# Altium schematic sheet Magnetorquer_drivers.SchDoc
size A4
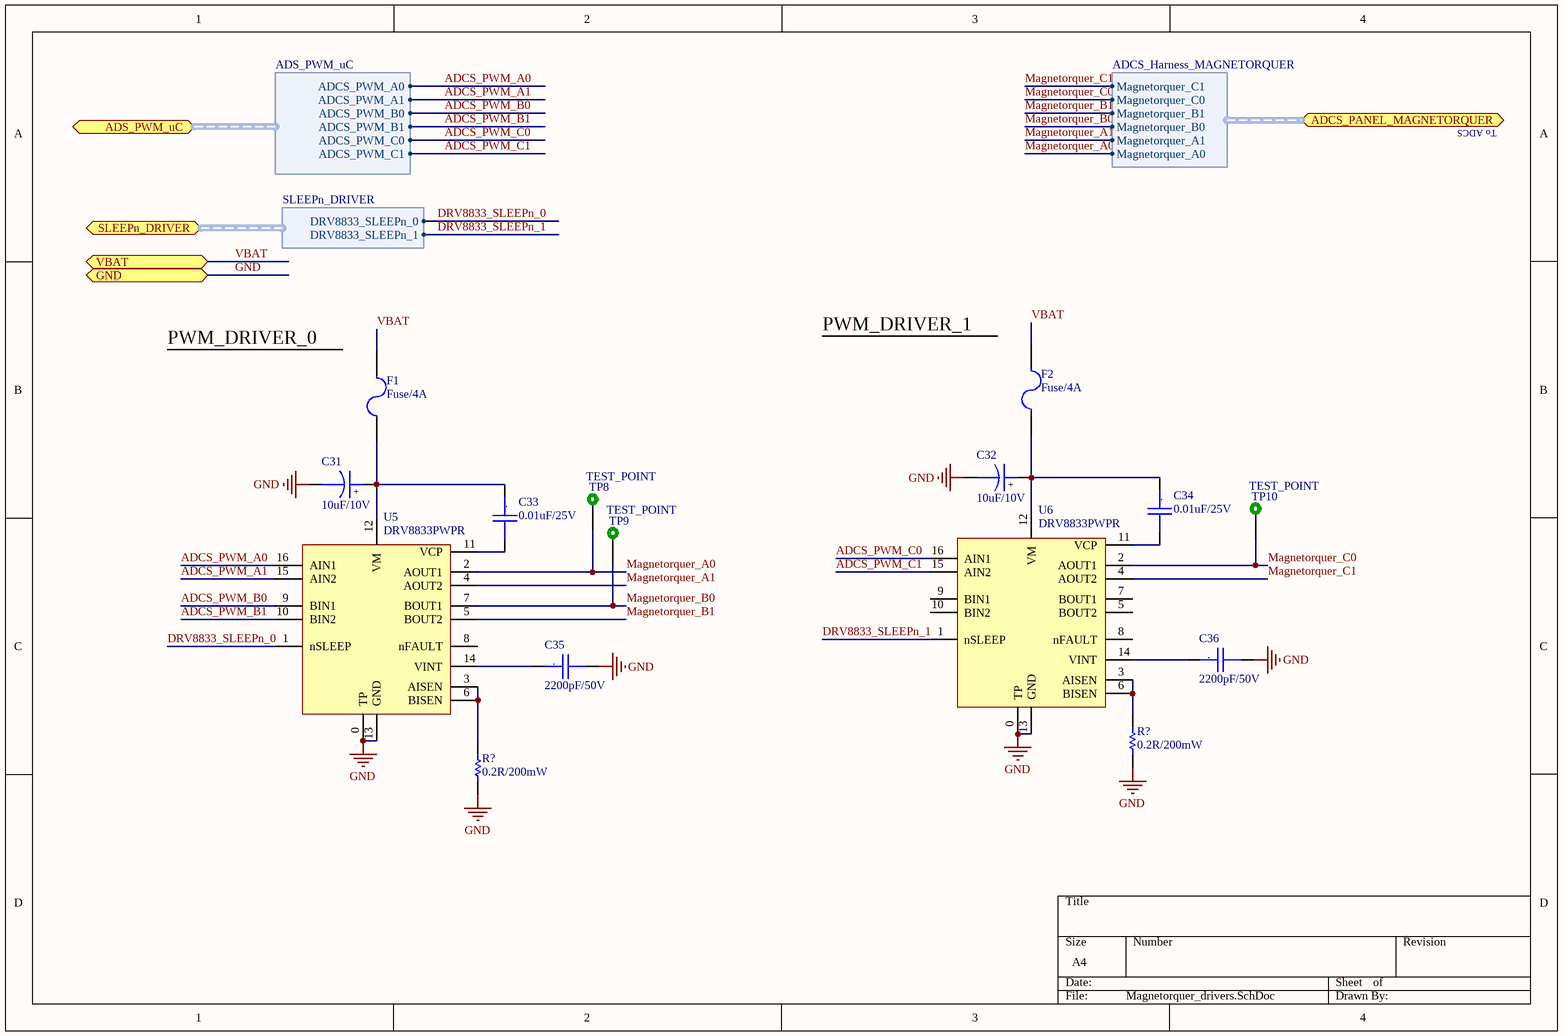
[diagram p0: Magnetorquer_drivers.SchDoc]

## Parts
(Parts that share a designator on the sheet are numbered #1, #2 ... from top to bottom, then left to right.)
C31  10uF/10V  [CC0603_Tantalum]
C32  10uF/10V  [CC0603_Tantalum]
C33  0.01uF/25V  [CC0603]
C34  0.01uF/25V  [CC0603]
C35  2200pF/50V  [CC0603]
C36  2200pF/50V  [CC0603]
F1  Fuse/4A  [fuse]
F2  Fuse/4A  [fuse]
R?#1  0.2R/200mW  [0603]
R?#2  0.2R/200mW  [0603]
TP8  TEST_POINT  [TEST_POINT]  (no BOM)
TP9  TEST_POINT  [TEST_POINT]  (no BOM)
TP10  TEST_POINT  [TEST_POINT]  (no BOM)
U5  DRV8833PWPR  [16TTSSOP]
U6  DRV8833PWPR  [16TTSSOP]

## Ports
ADCS_PANEL_MAGNETORQUER (harness ADCS_Harness_MAGNETORQUER), ADS_PWM_uC (harness ADS_PWM_uC), GND, SLEEPn_DRIVER (harness SLEEPn_DRIVER), VBAT

## Harnesses
ADCS_Harness_MAGNETORQUER: Magnetorquer_A0, Magnetorquer_A1, Magnetorquer_B0, Magnetorquer_B1, Magnetorquer_C0, Magnetorquer_C1
ADS_PWM_uC: ADCS_PWM_A1, ADCS_PWM_B0, ADCS_PWM_B1, ADCS_PWM_A0, ADCS_PWM_C0, ADCS_PWM_C1
SLEEPn_DRIVER: DRV8833_SLEEPn_0, DRV8833_SLEEPn_1

## Nets
GND: C31.2 C32.2 C35.2 C36.2 R?#1.1 R?#2.1 U5.0(TP) U5.13(GND) U6.0(TP) U6.13(GND) ; port GND
ADCS_PWM_A0: U5.16(AIN1) ; port ADS_PWM_uC.ADCS_PWM_A0
ADCS_PWM_A1: U5.15(AIN2) ; port ADS_PWM_uC.ADCS_PWM_A1
ADCS_PWM_B0: U5.9(BIN1) ; port ADS_PWM_uC.ADCS_PWM_B0
ADCS_PWM_B1: U5.10(BIN2) ; port ADS_PWM_uC.ADCS_PWM_B1
ADCS_PWM_C0: U6.16(AIN1) ; port ADS_PWM_uC.ADCS_PWM_C0
ADCS_PWM_C1: U6.15(AIN2) ; port ADS_PWM_uC.ADCS_PWM_C1
DRV8833_SLEEPn_0: U5.1(nSLEEP) ; port SLEEPn_DRIVER.DRV8833_SLEEPn_0
DRV8833_SLEEPn_1: U6.1(nSLEEP) ; port SLEEPn_DRIVER.DRV8833_SLEEPn_1
Magnetorquer_A0: TP8.1 U5.2(AOUT1) ; port ADCS_PANEL_MAGNETORQUER.Magnetorquer_A0
Magnetorquer_A1: U5.4(AOUT2) ; port ADCS_PANEL_MAGNETORQUER.Magnetorquer_A1
Magnetorquer_B0: TP9.1 U5.7(BOUT1) ; port ADCS_PANEL_MAGNETORQUER.Magnetorquer_B0
Magnetorquer_B1: U5.5(BOUT2) ; port ADCS_PANEL_MAGNETORQUER.Magnetorquer_B1
Magnetorquer_C0: TP10.1 U6.2(AOUT1) ; port ADCS_PANEL_MAGNETORQUER.Magnetorquer_C0
Magnetorquer_C1: U6.4(AOUT2) ; port ADCS_PANEL_MAGNETORQUER.Magnetorquer_C1
VBAT: F1.2 F2.2 ; port VBAT
NetC31_1: C31.1 C33.1 F1.1 U5.12(VM)
NetC32_1: C32.1 C34.1 F2.1 U6.12(VM)
NetC33_2: C33.2 U5.11(VCP)
NetC34_2: C34.2 U6.11(VCP)
NetC35_1: C35.1 U5.14(VINT)
NetC36_1: C36.1 U6.14(VINT)
NetR?#1_2: R?#1.2 U6.3(AISEN) U6.6(BISEN)
NetR?#2_2: R?#2.2 U5.3(AISEN) U5.6(BISEN)

Not connected (* = marked no-connect by the designer): U5 8(nFAULT); U6 5(BOUT2) 7(BOUT1) 8(nFAULT) 9(BIN1) 10(BIN2)

## Notes on the sheet
- To ADCS
- PWM_DRIVER_0
- PWM_DRIVER_1
- (in symbol Cap_Cer_X7R_0.01uF_25V_0603) .
- (in symbol Cap_Cer_X7R_2200pF_50V_0603) .
- (in symbol Cap_Tant_SMD_10uF_10V_0603) +

## Library data of the parts
C31 C32 = Cap_Tant_SMD_10uF_10V_0603: CAP Tantalum 10uF 10V 10% 0603; Partnumber: TACL106K010XTA; NCM: 8532.21.11
C33 C34 = Cap_Cer_X7R_0.01uF_25V_0603: CAP CER 0.01UF 25V 5% X7R 0603; Partnumber: 06033C103JAT2A; NCM: 8532.24.10
C35 C36 = Cap_Cer_X7R_2200pF_50V_0603: CAP CER 2200pF 50V 10% X7R 0603; Partnumber: GRM188R71H222KA01D; NCM: 8532.24.10
F1 F2 = Fuse: Surface Mount Fuses SMD FA 4A; PartNumber: 0476004.MRSN; Published: 8-Jun-2000; LatestRevisionDate: 17-Jul-2002; LatestRevisionNote: Re-released for DXP Platform.; PackageReference: PIN-W2/E2.8; Publisher: Altium Limited; PackageDescription: Thru-Hole; 2 Leads
R?#1 R?#2 = R0.2R_1%_200mW_0603: RES 0.2 OHM 200mW 1% 0603; Partnumber: RCWE0603R200FKEA; NCM: 8533.21.20
TP8-TP10 = TEST_POINT: Test point
U5 U6 = DRV8833PWPR: Partnumber: DRV8833PWPR